# Altium project reciever.PrjPcb
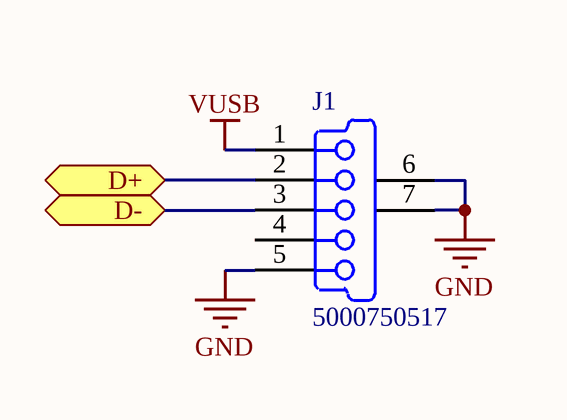
[diagram p0: connectors.SchDoc]
2 sheets, 4 parts. Net scope: flat (ports and power ports of the same name join across sheets).
Board file: reciever.PcbDoc
Sheets:
  connectors.SchDoc
  mcu.SchDoc

## Sheet connectors.SchDoc
size A

### Parts
J1  5000750517  [5000750517]

### Ports
D+ (bidir), D- (bidir)

### Nets
GND: J1.5(GND) J1.6(MH1) J1.7(MH2)
VUSB: J1.1(V_BUS)
NetJ1_2: J1.2(D-) ; port D+
NetJ1_3: J1.3(D+) ; port D-

Not connected (* = marked no-connect by the designer): J1 4(ID)

### Library data of the parts
J1 = 5000750517: USB On-The-Go (OTG) Mini-B Receptacle, Right Angle, Thru-Hole, 0.80mm (.031") Pitch, Solder Tails & Shell Tabs with Dimples; PCB_Layout: Complies with Manufacturer's Recommendation.; Published: 30-May-2008; DatasheetVersion: rev0, Mar-2004; PackageVersion: rev0, Mar-2004; PackageReference: 5000750517; Publisher: Altium Limited; PackageDescription: USB Mini-B, Type 2, Thru-Hole; 5 Position; Vertical, Body 7.7 x 4.2 x 7.7 mm (LxWxH); ComponentLink1Description: Manufacturer Link; ComponentLink1URL: http://www.molex.com/; ComponentLink2Description: Datasheet; ComponentLink2URL: http://www.molex.com/pdm_docs/sd/5000750517_sd.pdf

## Sheet mcu.SchDoc
size A
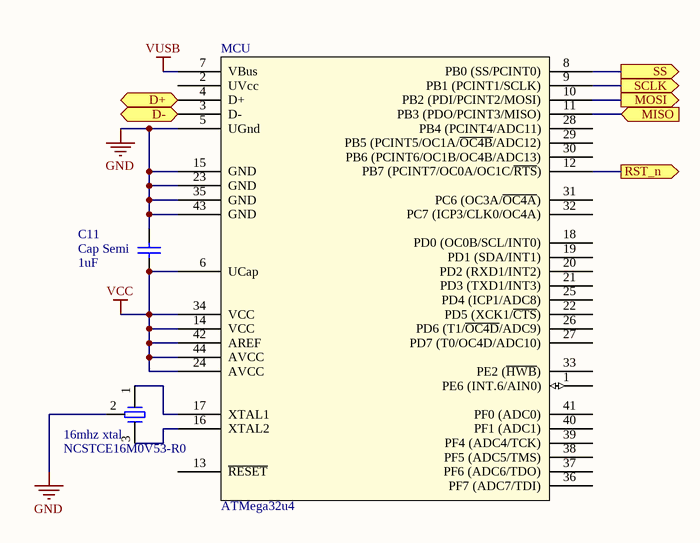
[diagram p1: mcu.SchDoc]

### Parts
16mhz_xtal  NCSTCE16M0V53-R0  [OSC]
C11  Cap Semi  value 1uF  [CAPC1608L]
MCU  ATMega32u4  [TQFP44_M]

### Ports
D+ (bidir), D- (bidir), MISO (in), MOSI (out), RST_n (out), SCLK (out), SS (out)

### Nets
GND: 16mhz_xtal.2 C11.2 MCU.5(UGnd) MCU.15(GND) MCU.23(GND) MCU.35(GND) MCU.43(GND)
VCC: C11.1 MCU.6(UCap) MCU.14(VCC) MCU.24(AVCC) MCU.34(VCC) MCU.42(AREF) MCU.44(AVCC)
VUSB: MCU.7(VBus)
Net16mhz_xtal_1: 16mhz_xtal.1 MCU.17(XTAL1)
Net16mhz_xtal_3: 16mhz_xtal.3 MCU.16(XTAL2)
NetJ1_2: MCU.4(D+) ; port D+
NetJ1_3: MCU.3(D-) ; port D-
NetMCU_8: MCU.8(PB0_(SS/PCINT0)) ; port SS
NetMCU_9: MCU.9(PB1_(PCINT1/SCLK)) ; port SCLK
NetMCU_10: MCU.10(PB2_(PDI/PCINT2/MOSI)) ; port MOSI
NetMCU_11: MCU.11(PB3_(PDO/PCINT3/MISO)) ; port MISO
NetMCU_12: MCU.12(PB7_(PCINT7/OC0A/OC1C/~{RTS})) ; port RST_n

Not connected (* = marked no-connect by the designer): MCU 1(PE6_(INT.6/AIN0)) 2(UVcc) 13(~{RESET}) 18(PD0_(OC0B/SCL/INT0)) 19(PD1_(SDA/INT1)) 20(PD2_(RXD1/INT2)) 21(PD3_(TXD1/INT3)) 22(PD5_(XCK1/~{CTS})) 25(PD4_(ICP1/ADC8)) 26(PD6_(T1/~{OC4D}/ADC9)) 27(PD7_(T0/OC4D/ADC10)) 28(PB4_(PCINT4/ADC11)) 29(PB5_(PCINT5/OC1A/~{OC4B}/ADC12)) 30(PB6_(PCINT6/OC1B/OC4B/ADC13)) 31(PC6_(OC3A/~{OC4A})) 32(PC7_(ICP3/CLK0/OC4A)) 33(PE2_(~{HWB})) 36(PF7_(ADC7/TDI)) 37(PF6_(ADC6/TDO)) 38(PF5_(ADC5/TMS)) 39(PF4_(ADC4/TCK)) 40(PF1_(ADC1)) 41(PF0_(ADC0))

### Library data of the parts
16mhz_xtal = NCSTCE16M0V53-R0: 16MHz crystal oscillator with built in load capacatenceardf
C11 = Cap Semi: Capacitor (Semiconductor SIM Model); Published: 8-Jun-2000; LatestRevisionDate: 29-May-2009; LatestRevisionNote: IPC-7351 Footprint Added.; PackageReference: C1206; Publisher: Altium Limited; PackageDescription: Chip Capacitor
MCU = ATMega32u4: usb enabled avr microcontroller

## Nets that join several sheets
GND: connectors (J1.5 J1.6 J1.7), mcu (7 pins)
VUSB: connectors (J1.1), mcu (MCU.7)
NetJ1_2: connectors (J1.2), mcu (MCU.4)
NetJ1_3: connectors (J1.3), mcu (MCU.3)